# Altium schematic sheet 3.3V.SchDoc
size A4; SheetNumber: 7; SheetTotal: 8
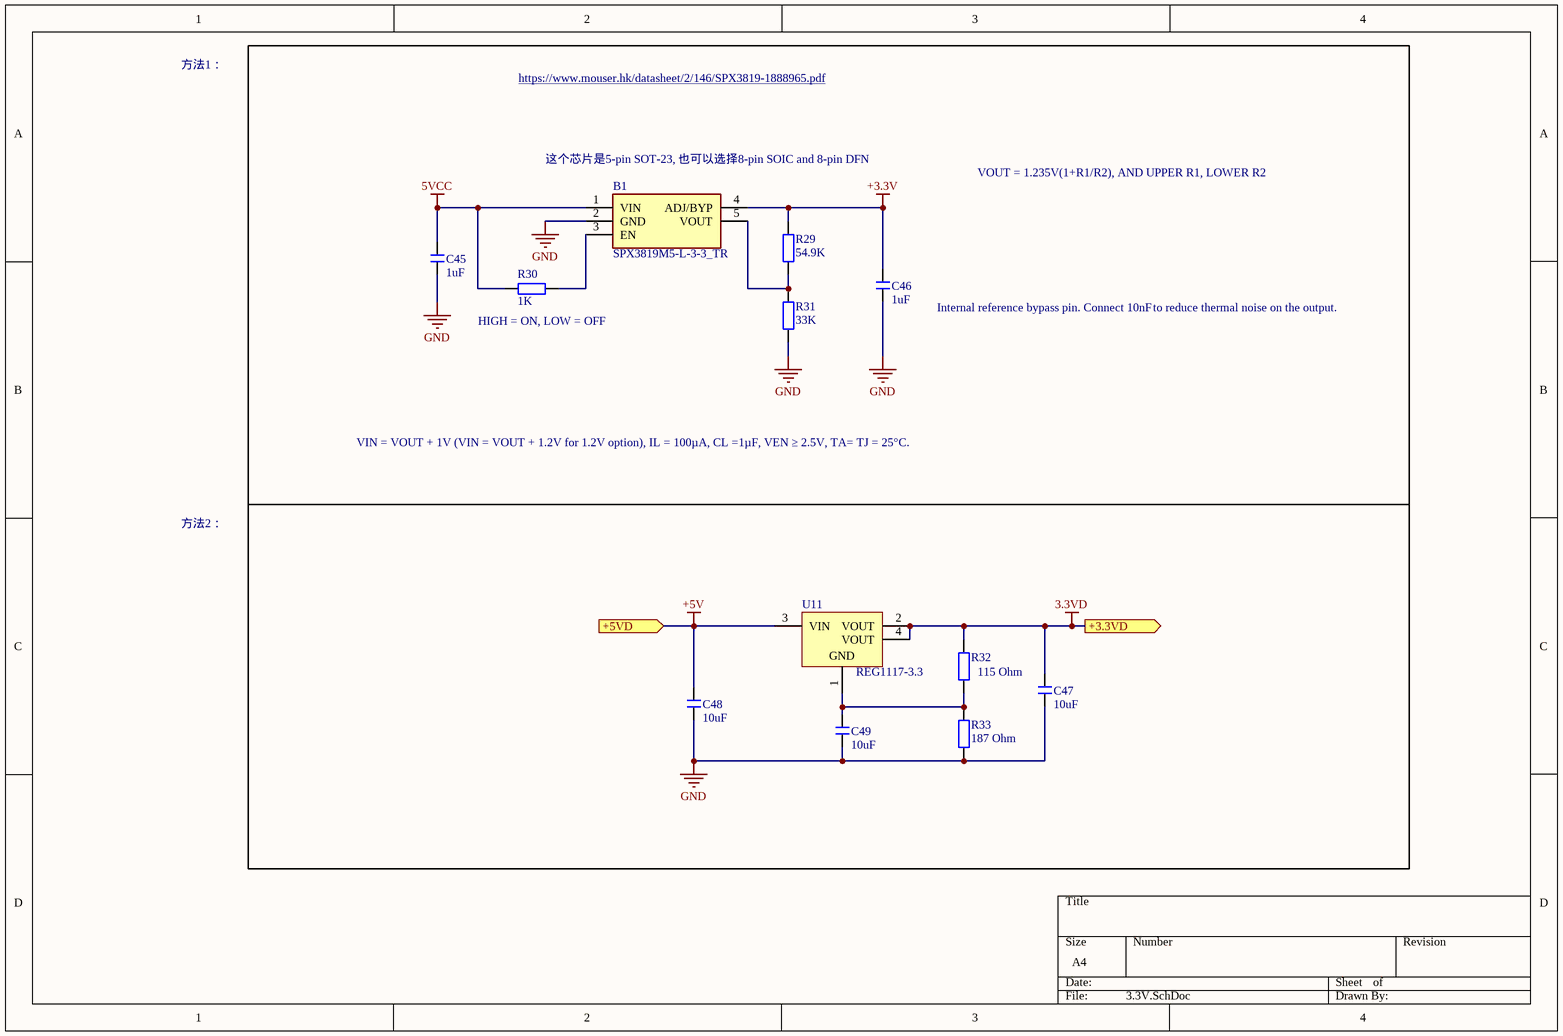
[diagram p0: 3.3V.SchDoc]

## Parts
B1  SPX3819M5-L-3-3_TR  [SOT95P280X145-5N]
C45  1uF  [C 0805_L]
C46  1uF  [C 0805_L]
C47  10uF  [C 0805_L]
C48  10uF  [C 0805_L]
C49  10uF  [C 0805_L]
R29  54.9K  [R 0805_L]
R30  1K  [R 0805_L]
R31  33K  [R 0805_L]
R32  115 Ohm  [R 0805_L]
R33  187 Ohm  [R 0805_L]
U11  REG1117-3.3  [DCY0004A_M]

## Ports
+3.3VD (out, see DC_SUPPLY[2D]), +5VD (in, see DC_SUPPLY[2D], 1VD, 1.5VD, 1.8VD, 3.3VD, 3.3VA[1B], 5VD_and_5VDC_and_12V[3B], VTTVREF[2B])

## Nets
3.3VD: C47.2 R32.2 U11.2(VOUT) U11.4(VOUT) ; port +3.3VD
5VCC: B1.1(VIN) C45.2 R30.1
+3.3V: B1.4(ADJ/BYP) C46.2 R29.2
+5V: C48.2 U11.3(VIN) ; port +5VD
GND: B1.2(GND) C45.1 C46.1 C47.1 C48.1 C49.1 R31.1 R33.1
NetB1_3: B1.3(EN) R30.2
NetB1_5: B1.5(VOUT) R29.1 R31.2
NetC49_2: C49.2 R32.1 R33.2 U11.1(GND)

## Notes on the sheet
- 方法1：
- https://www.mouser.hk/datasheet/2/146/SPX3819-1888965.pdf
- (near B1) 这个芯片是5-pin SOT-23, 也可以选择8-pin SOIC and 8-pin DFN
- VOUT = 1.235V(1+R1/R2), AND UPPER R1, LOWER R2
- Internal reference bypass pin. Connect 10nF
- to reduce thermal noise on the output.
- (near R30) HIGH = ON, LOW = OFF
- VIN = VOUT + 1V (VIN = VOUT + 1.2V for 1.2V option), IL = 100µA, CL =1µF, VEN ≥ 2.5V, TA= TJ = 25°C.
- 方法2：

## Library data of the parts
B1 = SPX3819M5-L-3-3_TR: EXAR SPX3819M5-L-3-3/TR, Low Noise LDO Voltage Regulator, 100mA, 3.3 V, 1%, 2.5  16 Vin 5-Pin, SOT-23; Geometry.Height: 1.45mm; Mouser Part Number: 701-SPX3819M5-L-33TR; Mouser Price/Stock: https://www.mouser.com/Search/Refine.aspx?Keyword=701-SPX3819M5-L-33TR; Manufacturer_Name: EXAR; Manufacturer_Part_Number: SPX3819M5-L-3-3/TR; Datasheet Link: https://componentsearchengine.com/Datasheets/1/SPX3819M5-L-3-3_TR.pdf
C45-C49 = C: 贴片电容; BOM名称: 无极性贴片电容; 淘宝ID: 封装库来自淘宝 ID：黄晶宝石; 联系售后，技术支持: https://shop463601444.taobao.com; 唯一出售店铺网址: https://shop463601444.taobao.com
R29-R33 = R: 贴片电阻; 版权归属: 来自淘宝 ID：黄晶宝石; 封装库来自淘宝卖家 ID：黄晶宝石: 其他店铺购入均为盗版，不享受售后技术支持服务，请立即申请退款; BOM名称: 贴片电阻; 联系售后: https://shop463601444.taobao.com
U11 = CMP-0395-00549-2: Single Output LDO, 800 mA, Fixed 3.3 V Output, 3.8 to 15 V Input, with Internal Current Limiting, 4-pin SOT-223 (DCY), -40 to 125 degC, Green (RoHS & no Sb/Br); Manufacturer: Texas Instruments; Vout Adj(Max)(V): 3.3; Vin(Max)(V): 15; Iq(Typ)(mA): 4; Iout(Max)(A): 0.8; Vdo(Typ)(mV): 1100; Vin(Min)(V): 3.8; SubFamily: Single Channel LDO; Rating: Catalog; Fixed Output Options(V): 5; ComponentLink1Description: Manufacturer URL; Eco-Plan: Green (RoHS & no Sb/Br); PackageReference: DCY0004A; Mounting Technology: Surface Mount; ComponentLink3Description: Package Specification; Vout Adj(Min)(V): 3.3; ComponentLink2URL: http://www.ti.com/general/docs/lit/getliterature.tsp?genericPartNumber=REG1117-33&fileType=pdf; PackageVersion: 4202506/B; ComponentLink3URL: http://www.ti.com/litv/pdf/mpds094a; Code_JEDEC: TO-261; ComponentLink1URL: http://www.ti.com/; ComponentLink2Description: Datasheet; PartNumber: REG1117-3.3; DatasheetVersion: SBVS001D; PackageDescription: 4-Pin Plastic Small Outline, Body 3.5 x 6.5 mm, Pitch 2.3 mm